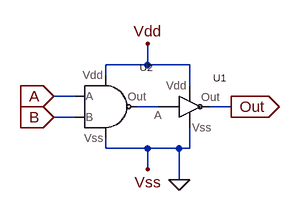
[diagram p0: schematic AND1.asc]
AND1.asc, the LTspice schematic file:
Version 4
SHEET 1 880 680
WIRE 160 96 160 64
WIRE 160 96 96 96
WIRE 224 96 160 96
WIRE 96 112 96 96
WIRE 224 128 224 96
WIRE 48 144 16 144
WIRE 176 160 144 160
WIRE 288 160 256 160
WIRE 48 176 16 176
WIRE 96 224 96 208
WIRE 160 224 96 224
WIRE 208 224 160 224
WIRE 224 224 224 192
WIRE 224 224 208 224
WIRE 160 256 160 224
WIRE 208 272 208 224
FLAG 288 160 Out
IOPIN 288 160 Out
FLAG 16 144 A
IOPIN 16 144 In
FLAG 16 176 B
IOPIN 16 176 In
FLAG 160 64 Vdd
FLAG 160 256 Vss
FLAG 208 272 0
SYMBOL NOT1 208 160 R0
SYMATTR InstName U1
SYMBOL NAND1 64 160 R0
SYMATTR InstName U2

The netlist it stands for:
* AND1.asc
XU1 Vdd 0 N001 Out NOT1  ; pins Vdd Vss A Out
XU2 A B N001 0 Vdd NAND1  ; pins A B Out Vss Vdd
.lib NOT1.sub
.lib NAND1.sub
.backanno
.end